# EAGLE design Hardware-Neuron (EAGLE 9.3.0)
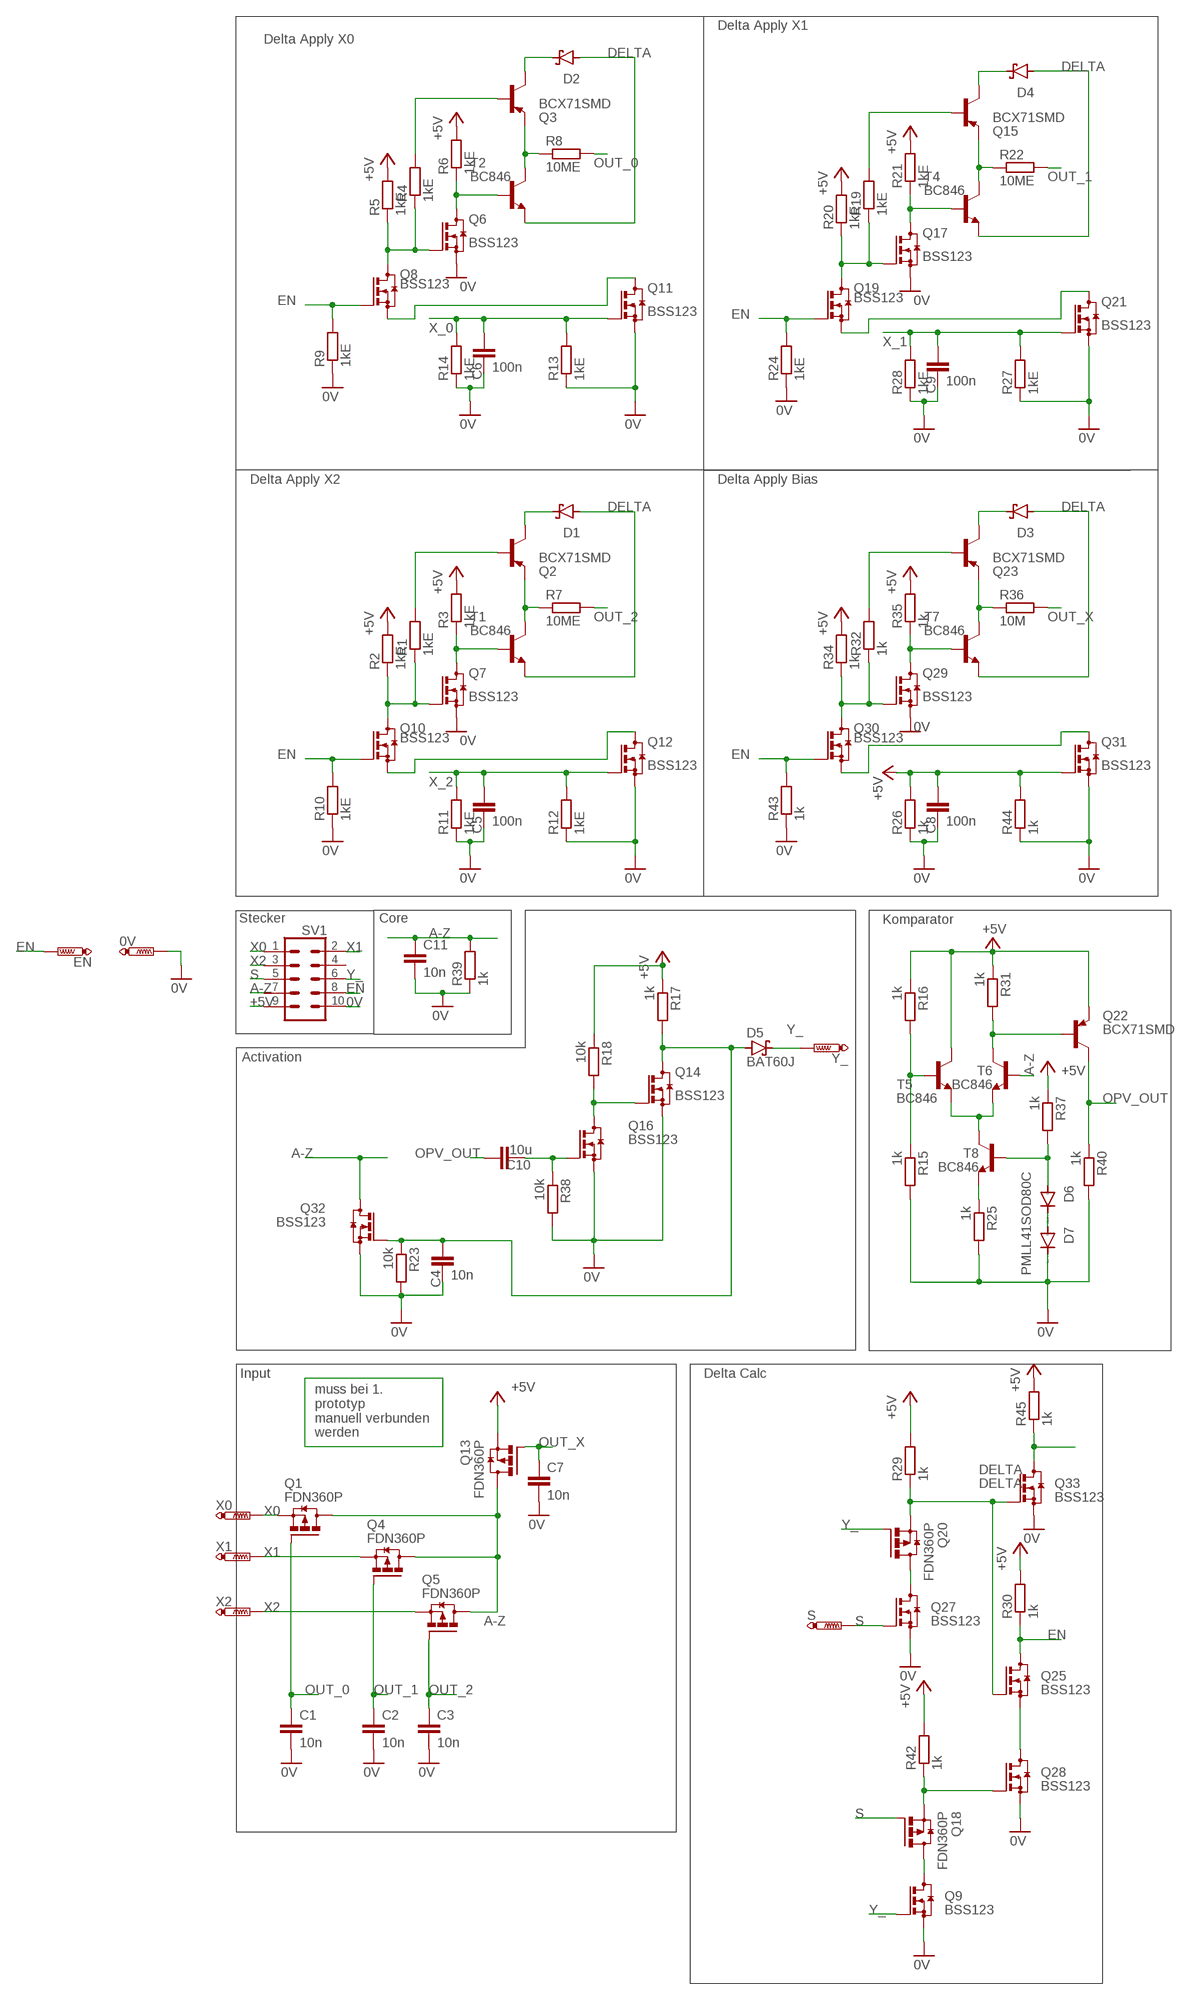
[diagram p0: schematic, sheet 1]

## Parts
0V  PTR1PAD1-17  [P1-17]
C1  10n  C-EUC0805  [C0805]
C2  10n  C-EUC0805  [C0805]
C3  10n  C-EUC0805  [C0805]
C4  10n  C-EUC0805  [C0805]
C5  100n  C-EUC0805  [C0805]
C6  100n  C-EUC0805  [C0805]
C7  10n  C-EUC0805  [C0805]
C8  100n  C-EUC0805  [C0805]
C9  100n  C-EUC0805  [C0805]
C10  10u  C-EUC0805  [C0805]
C11  10n  C-EUC0805  [C0805]
D1  BAT60J  [SOD323_ST]
D2  BAT60J  [SOD323_ST]
D3  BAT60J  [SOD323_ST]
D4  BAT60J  [SOD323_ST]
D5  BAT60J  [SOD323_ST]
D6  PMLL41SOD80C  [SOD80C]
D7  PMLL41SOD80C  [SOD80C]
EN  PTR1PAD1-17  [P1-17]
Q1  FDN360P  [SUPER-SOT3]
Q2  BCX71SMD  [SOT23]
Q3  BCX71SMD  [SOT23]
Q4  FDN360P  [SUPER-SOT3]
Q5  FDN360P  [SUPER-SOT3]
Q6  BSS123  [SOT23]
Q7  BSS123  [SOT23]
Q8  BSS123  [SOT23]
Q9  BSS123  [SOT23]
Q10  BSS123  [SOT23]
Q11  BSS123  [SOT23]
Q12  BSS123  [SOT23]
Q13  FDN360P  [SUPER-SOT3]
Q14  BSS123  [SOT23]
Q15  BCX71SMD  [SOT23]
Q16  BSS123  [SOT23]
Q17  BSS123  [SOT23]
Q18  FDN360P  [SUPER-SOT3]
Q19  BSS123  [SOT23]
Q20  FDN360P  [SUPER-SOT3]
Q21  BSS123  [SOT23]
Q22  BCX71SMD  [SOT23]
Q23  BCX71SMD  [SOT23]
Q25  BSS123  [SOT23]
Q27  BSS123  [SOT23]
Q28  BSS123  [SOT23]
Q29  BSS123  [SOT23]
Q30  BSS123  [SOT23]
Q31  BSS123  [SOT23]
Q32  BSS123  [SOT23]
Q33  BSS123  [SOT23]
R1  1kE  R-EU_M0805  [M0805]
R2  1kE  R-EU_M0805  [M0805]
R3  1kE  R-EU_M0805  [M0805]
R4  1kE  R-EU_M0805  [M0805]
R5  1kE  R-EU_M0805  [M0805]
R6  1kE  R-EU_M0805  [M0805]
R7  10ME  R-EU_M0805  [M0805]
R8  10ME  R-EU_M0805  [M0805]
R9  1kE  R-EU_M0805  [M0805]
R10  1kE  R-EU_M0805  [M0805]
R11  1kE  R-EU_M0805  [M0805]
R12  1kE  R-EU_M0805  [M0805]
R13  1kE  R-EU_M0805  [M0805]
R14  1kE  R-EU_M0805  [M0805]
R15  1k  R-EU_M0805  [M0805]
R16  1k  R-EU_M0805  [M0805]
R17  1k  R-EU_M0805  [M0805]
R18  10k  R-EU_M0805  [M0805]
R19  1kE  R-EU_M0805  [M0805]
R20  1kE  R-EU_M0805  [M0805]
R21  1kE  R-EU_M0805  [M0805]
R22  10ME  R-EU_M0805  [M0805]
R23  10k  R-EU_M0805  [M0805]
R24  1kE  R-EU_M0805  [M0805]
R25  1k  R-EU_M0805  [M0805]
R26  1k  R-EU_M0805  [M0805]
R27  1kE  R-EU_M0805  [M0805]
R28  1kE  R-EU_M0805  [M0805]
R29  1k  R-EU_M0805  [M0805]
R30  1k  R-EU_M0805  [M0805]
R31  1k  R-EU_M0805  [M0805]
R32  1k  R-EU_M0805  [M0805]
R34  1k  R-EU_M0805  [M0805]
R35  1k  R-EU_M0805  [M0805]
R36  10M  R-EU_M0805  [M0805]
R37  1k  R-EU_M0805  [M0805]
R38  10k  R-EU_M0805  [M0805]
R39  1k  R-EU_M0805  [M0805]
R40  1k  R-EU_M0805  [M0805]
R42  1k  R-EU_M0805  [M0805]
R43  1k  R-EU_M0805  [M0805]
R44  1k  R-EU_M0805  [M0805]
R45  1k  R-EU_M0805  [M0805]
S  PTR1PAD1-17  [P1-17]
SV1  ML10  [ML10]
T1  BC846  [SOT23]
T2  BC846  [SOT23]
T4  BC846  [SOT23]
T5  BC846  [SOT23]
T6  BC846  [SOT23]
T7  BC846  [SOT23]
T8  BC846  [SOT23]
X0  PTR1PAD1-17  [P1-17]
X1  PTR1PAD1-17  [P1-17]
X2  PTR1PAD1-17  [P1-17]
Y_  PTR1PAD1-17  [P1-17]

## Nets
0V: 0V.TP C1.2 C2.2 C3.2 C4.2 C5.2 C6.2 C7.2 C8.2 C9.2 C11.2 D7.C Q6.2(S) Q7.2(S) Q9.2(S) Q11.2(S) Q12.2(S) Q14.2(S) Q16.2(S) Q17.2(S) Q21.2(S) Q27.2(S) Q28.2(S) Q29.2(S) Q31.2(S) Q32.2(S) Q33.2(S) R9.1 R10.1 R11.1 R12.1 R13.1 R14.1 R15.2 R23.2 R24.1 R25.2 R26.1 R27.1 R28.1 R38.2 R39.1 R40.2 R43.1 R44.1 SV1.10
+5V: C8.1 Q13.2(S) Q22.2(E) Q31.1(G) R2.2 R3.2 R5.2 R6.2 R16.1 R17.1 R18.1 R20.2 R21.2 R26.2 R29.2 R30.2 R31.1 R34.2 R35.2 R37.1 R42.2 R44.2 R45.2 SV1.9 T5.3(C)
A-Z: C11.1 Q1.3(D) Q4.3(D) Q5.3(D) Q13.3(D) Q32.3(D) R39.2 SV1.7 T6.1(B)
DELTA: D1.A D2.A D3.A D4.A Q20.2(S) Q25.1(G) Q33.1(G) R29.1 T1.2(E) T2.2(E) T4.2(E) T7.2(E)
EN: EN.TP Q8.1(G) Q10.1(G) Q19.1(G) Q25.3(D) Q30.1(G) R9.2 R10.2 R24.2 R30.1 R43.2 SV1.8
N$1: Q29.3(D) R35.1 T7.1(B)
N$2: Q23.2(E) R36.1 T7.3(C)
N$3: C10.2 Q16.1(G) R38.1
N$4: Q33.3(D) R45.1
N$5: Q14.1(G) Q16.3(D) R18.2
N$6: Q6.3(D) R6.1 T2.1(B)
N$7: Q8.2(S) Q11.3(D)
N$8: Q3.2(E) R8.1 T2.3(C)
N$9: D3.C Q23.3(C)
N$10: Q23.1(B) R32.2
N$11: Q29.1(G) Q30.3(D) R32.1 R34.1
N$12: Q30.2(S) Q31.3(D)
N$13: D6.C D7.A
N$14: R15.1 R16.2 T5.1(B)
N$16: C4.1 D5.A Q14.3(D) Q32.1(G) R17.2 R23.1
N$17: Q9.3(D) Q18.3(D)
N$25: R25.1 T8.2(E)
N$26: Q22.1(B) R31.2 T6.3(C)
N$27: T5.2(E) T6.2(E) T8.3(C)
N$28: Q17.3(D) R21.1 T4.1(B)
N$29: D6.A R37.2 T8.1(B)
N$31: D2.C Q3.3(C)
N$32: Q20.3(D) Q27.3(D)
N$33: Q15.2(E) R22.1 T4.3(C)
N$34: Q3.1(B) R4.2
N$35: Q6.1(G) Q8.3(D) R4.1 R5.1
N$36: Q18.2(S) Q28.1(G) R42.1
N$38: D4.C Q15.3(C)
N$39: Q15.1(B) R19.2
N$40: Q25.2(S) Q28.3(D)
N$41: Q17.1(G) Q19.3(D) R19.1 R20.1
N$42: Q19.2(S) Q21.3(D)
N$50: Q7.3(D) R3.1 T1.1(B)
N$51: Q2.2(E) R7.1 T1.3(C)
N$52: D1.C Q2.3(C)
N$53: Q2.1(B) R1.2
N$54: Q7.1(G) Q10.3(D) R1.1 R2.1
N$55: Q10.2(S) Q12.3(D)
OPV_OUT: C10.1 Q22.3(C) R40.1
OUT_0: C1.1 Q1.1(G) R8.2
OUT_1: C2.1 Q4.1(G) R22.2
OUT_2: C3.1 Q5.1(G) R7.2
OUT_X: C7.1 Q13.1(G) R36.2
S: Q18.1(G) Q27.1(G) S.TP SV1.5
X0: Q1.2(S) SV1.1 X0.TP
X1: Q4.2(S) SV1.2 X1.TP
X2: Q5.2(S) SV1.3 X2.TP
X_0: C6.1 Q11.1(G) R13.2 R14.2
X_1: C9.1 Q21.1(G) R27.2 R28.2
X_2: C5.1 Q12.1(G) R11.2 R12.2
Y_: D5.C Q9.1(G) Q20.1(G) SV1.6 Y_.TP
Unconnected: SV1.4

## Notes on the sheet
- Delta Apply X1
- Delta Apply X0
- Delta Apply X2 | Delta Apply Bias
- Stecker | Core | Komparator
- Activation
- Input | Delta Calc
- muss bei 1.
  prototyp 
  manuell verbunden
  werden

## Library data of the parts
0V EN S X0 X1 X2 Y_ = testpad:PTR1: TEST PIN
C1-C11 = rcl:C-EU: CAPACITOR, European symbol; SPICEPREFIX: C
D1-D5 = diode:BAT60J: Schottky barrier diode Source: www.st.com, BAT60J.pdf
D6 D7 = diode:PMLL41*: High-speed diodes Source: http://www.semiconductors.philips.com/acrobat_download/datasheets/PMLL4150_2.pdf
Q1 Q4 Q5 Q13 Q18 Q20 = transistor-power:FDN360P: Single P-Channel, PowerTrench (R) MOSFET Source: http://www.fairchildsemi.com/ds/FD/FDN360P.pdf
Q2 Q3 Q15 Q22 Q23 = transistor-pnp:BCX71SMD: PNP Transistor
Q6-Q12 Q14 Q16 Q17 Q19 Q21 Q25 Q27-Q33 = transistor-small-signal:BSS123: N-CHANNEL MOS FET
R1-R32 R34-R40 R42-R45 = rcl:R-EU_: RESISTOR, European symbol; SPICEPREFIX: R
SV1 = con-harting-ml:ML10: HARTING; OC_FARNELL: unknown; OC_NEWARK: unknown
T1 T2 T4-T8 = transistor:BC846: NPN TRANSISTOR

## Board
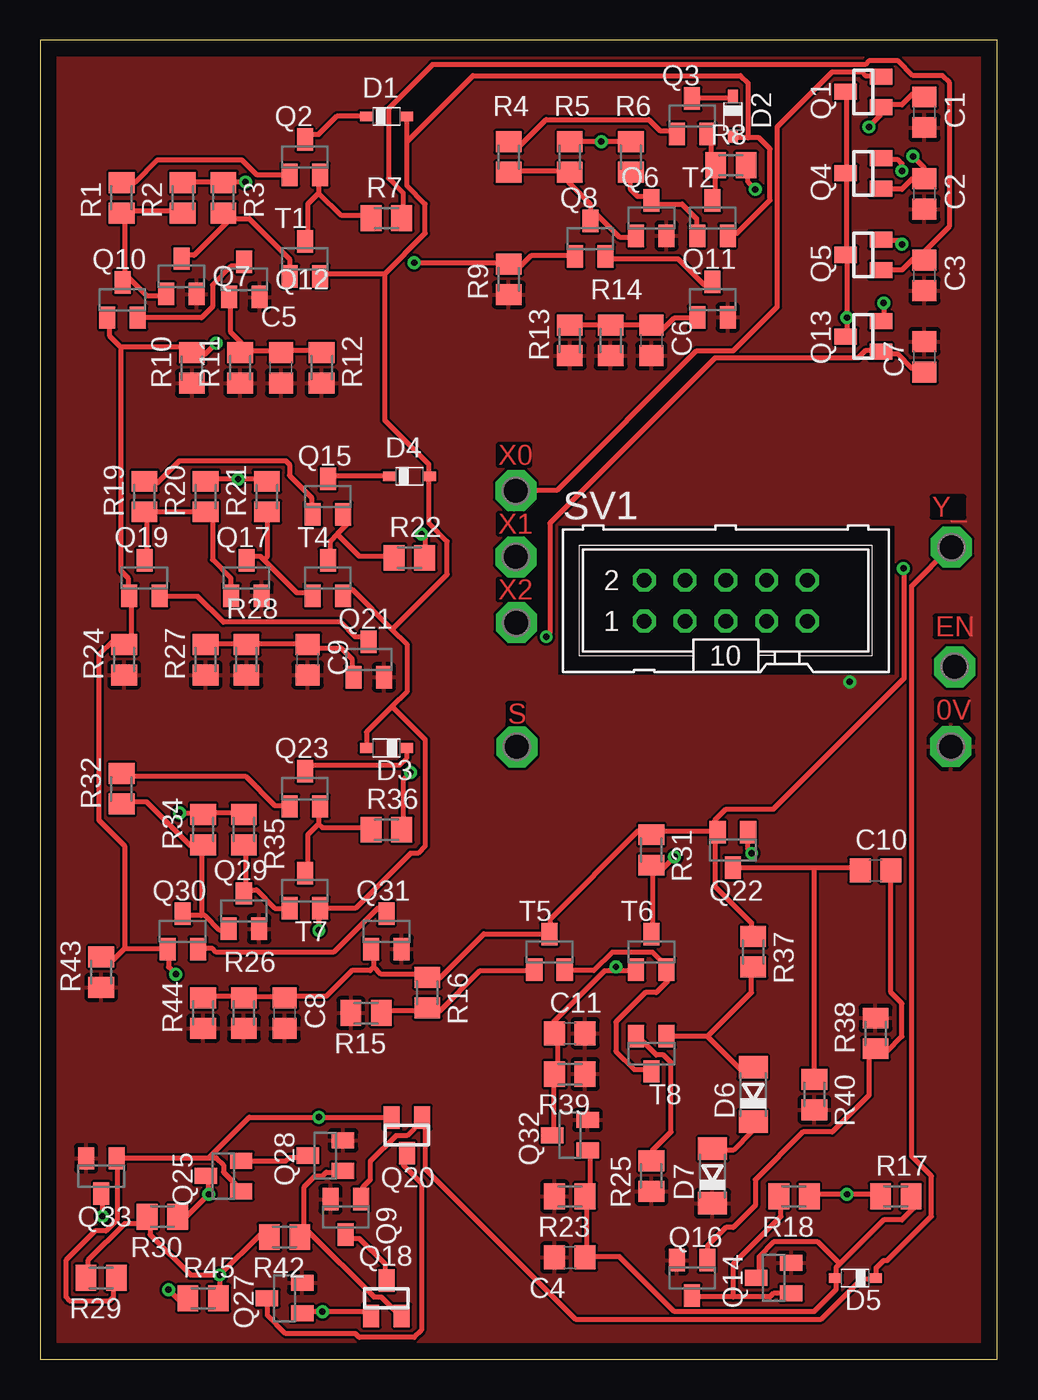
[diagram p1: board, top side]
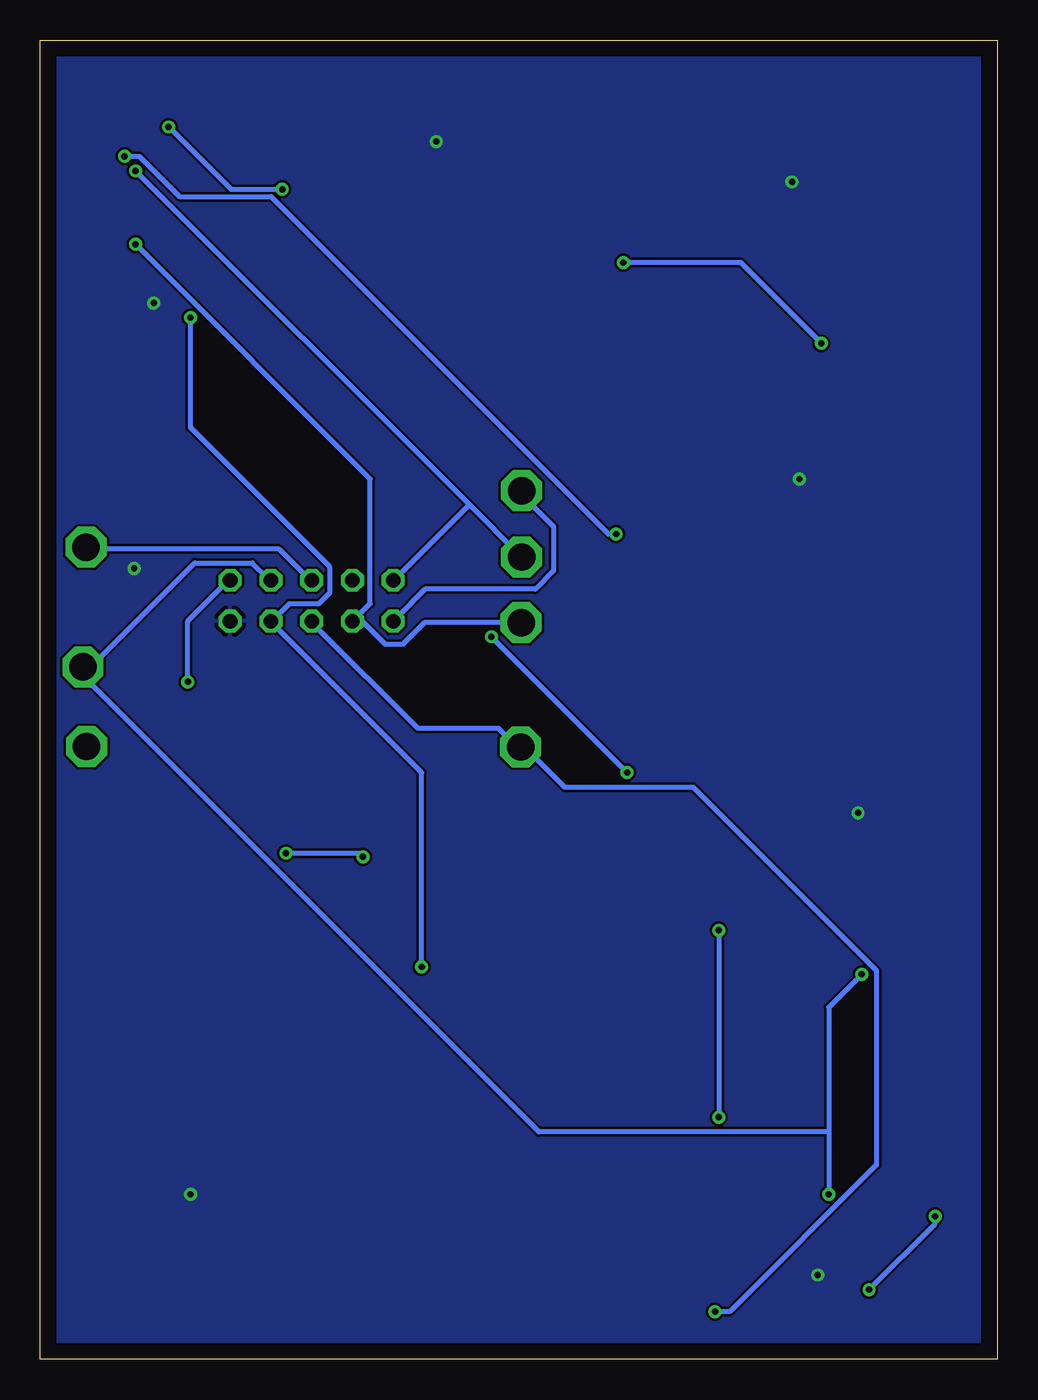
[diagram p2: board, bottom side, seen from below]

Size 59.67 x 82.22 mm. Coordinates in mm from the lower left corner, seen from the top.
Outline: 0,0 59.67,0 59.67,82.22 0,82.22 0,0
Copper layers (1*16): Top 0.035mm / dielectric 1.5mm / Bottom 0.035mm
Design rules "default *": minimum track width 12mil, minimum drill 0.4mm, track to track 6mil, track to pad 6mil, pad to pad 6mil, via to via 6mil, smd to smd 6mil, copper to edge 40mil, drill to drill 6mil, minimum pad ring 10mil, minimum via ring 8mil, stop-mask expansion 4mil, vias tented up to drill 0mil, thermal gap 10mil
tKeepout: area 32.4,48.5 to 55.1,58.3
tRestrict: area 32.3,42.7 to 53.3,51.9

### Footprints (pad centres in the part's own frame; a part is rotated, then mirrored left to right if it is on the bottom)
P1-17 = drill 1.702 pad 2.54 octagon: TP 0,0
C0805 = smd 1.3 x 1.5: 1 -0.95,0; 2 0.95,0
SOD323_ST = smd 0.8 x 0.6: A 1.25,0; C -1.25,0
SOD80C = smd 1.4 x 1.8: A 1.7,0; C -1.7,0
SUPER-SOT3 = smd 1 x 1.4: 1 -0.95,-1.1; 2 0.95,-1.1; 3 0,1.1
SOT23 = smd 1 x 1.4: 1 -0.95,-1.1; 2 0.95,-1.1; 3 0,1.1
M0805 = smd 1.3 x 1.6: 1 -0.95,0; 2 0.95,0
ML10 = drill 0.914 octagon: 1 -5.08,-1.27; 2 -5.08,1.27; 3 -2.54,-1.27; 4 -2.54,1.27; 5 0,-1.27; 6 0,1.27; 7 2.54,-1.27; 8 2.54,1.27; 9 5.08,-1.27; 10 5.08,1.27

### Placement (x,y rotation side)
0V  56.77,38.19 0 top
C1  55.12,77.72 270 top
C2  55.12,72.64 270 top
C3  55.12,67.56 270 top
C4  33.02,6.35 180 top
C5  15.01,61.8 270 top
C6  38.1,63.5 270 top
C7  55.12,62.48 90 top
C8  15.24,21.59 270 top
C9  16.67,43.61 270 top
C10  52.07,30.48 0 top
C11  33.02,20.32 0 top
D1  21.59,77.47 0 top
D2  43.18,77.47 270 top
D3  21.59,38.1 180 top
D4  23.02,55.04 0 top
D5  50.8,5.08 180 top
D6  44.45,16.51 90 top
D7  41.91,11.43 90 top
EN  57,43.16 0 top
Q1  51.31,78.99 90 top
Q2  16.51,74.93 0 top
Q3  40.64,77.47 0 top
Q4  51.31,73.91 90 top
Q5  51.31,68.83 90 top
Q6  38.1,71.12 0 top
Q7  8.82,67.5 0 top
Q8  34.29,69.85 0 top
Q9  19.05,8.89 180 top
Q10  5.14,66.02 0 top
Q11  41.91,66.04 0 top
Q12  12.72,67.3 0 top
Q13  51.31,63.75 90 top
Q14  45.72,5.08 90 top
Q15  17.94,53.77 0 top
Q16  40.64,5.08 180 top
Q17  12.86,48.69 0 top
Q18  21.59,3.81 0 top
Q19  6.51,48.69 0 top
Q20  22.86,13.97 180 top
Q21  20.48,43.61 0 top
Q22  43.18,31.75 180 top
Q23  16.51,35.56 0 top
Q25  11.43,11.43 90 top
Q27  15.24,3.81 90 top
Q28  17.78,12.7 90 top
Q29  12.7,27.94 0 top
Q30  8.89,26.67 0 top
Q31  21.59,26.67 0 top
Q32  33.02,13.97 90 top
Q33  3.81,11.43 180 top
R1  5.08,72.39 90 top
R2  8.89,72.39 90 top
R3  11.43,72.39 90 top
R4  29.21,74.93 90 top
R5  33.02,74.93 90 top
R6  36.83,74.93 90 top
R7  21.59,71.12 0 top
R8  43.05,74.42 0 top
R9  29.21,67.31 90 top
R10  9.47,61.78 90 top
R11  12.47,61.8 90 top
R12  17.55,61.8 90 top
R13  33.02,63.5 90 top
R14  35.56,63.5 90 top
R15  20.32,21.59 180 top
R16  24.13,22.86 270 top
R17  53.34,10.16 0 top
R18  46.99,10.16 180 top
R19  6.51,53.77 90 top
R20  10.32,53.77 90 top
R21  14.13,53.77 90 top
R22  23.02,49.96 0 top
R23  33.02,10.16 180 top
R24  5.24,43.61 90 top
R25  38.1,11.43 270 top
R26  12.7,21.59 90 top
R27  10.32,43.61 90 top
R28  12.86,43.61 90 top
R29  3.81,5.08 180 top
R30  7.62,8.89 180 top
R31  38.1,31.75 270 top
R32  5.08,35.56 90 top
R34  10.16,33.02 90 top
R35  12.7,33.02 90 top
R36  21.59,33.02 0 top
R37  44.45,25.4 270 top
R38  52.07,20.32 90 top
R39  33.02,17.78 180 top
R40  48.26,16.51 270 top
R42  15.24,7.62 180 top
R43  3.81,24.13 90 top
R44  10.16,21.59 90 top
R45  10.16,3.81 0 top
S  29.71,38.17 0 top
SV1  42.74,47.28 0 top
T1  16.51,68.58 0 top
T2  41.91,71.12 0 top
T4  17.94,48.69 0 top
T5  31.75,25.4 0 top
T6  38.1,25.4 0 top
T7  16.51,29.21 0 top
T8  38.1,19.05 180 top
X0  29.66,54.14 0 top
X1  29.66,50.01 0 top
X2  29.69,45.91 0 top
Y_  56.81,50.61 0 top

### Tracks (layer width: path | path; a pad name or v marks a point on that pad's centre or on a via)
0V  (via drill 0.4)
  Bottom 0.305: v50.46,42.23 50.46,46.01 48.01,48.46 SV1.10
  pour Top: 0.19,82.1 0.19,-0.03 59.68,-0.03 59.68,82.1
+5V  (via drill 0.4)
  Top 0.305: R44.2 10.29,22.63 12.57,22.63 R26.2 12.8,22.63 15.09,22.63 C8.1 15.32,22.63 17.83,22.63 19.43,24.23 20.57,24.23 20.8,24.46 | 20.8,24.46 20.8,25.38 Q31.1 | 20.8,24.46 21.26,24 24,24 R16.1 24.23,23.77 24.92,23.77 27.66,26.52 31.55,26.52 T5.3 31.77,26.52 31.77,27.43 37.26,32.92 37.95,32.92 R31.1 38.18,32.92 42.06,32.92 | v11.2,5.26 11.2,3.89 R45.2 | v11.2,5.26 13.72,7.77 14.17,7.77 R42.2 | R29.2 2.97,5.26 2.97,6.17 5.26,8.46 6.4,8.46 6.63,8.69 R30.2 6.86,8.69 6.86,7.77 9.37,5.26 v11.2,5.26 | R18.1 48.01,10.29 v50.29,10.29 52.35,10.29 R17.1 | R5.2 33.15,75.89 v34.98,75.89 36.8,75.89 R6.2 | R20.2 10.52,54.86 v12.34,54.86 13.95,54.86 R21.2 | 11.43,73.38 8.91,73.38 R2.2 | R35.2 12.57,34.06 10.29,34.06 R34.2 10.06,34.06 v8.69,34.06 | v52.58,65.84 52.58,64.92 Q13.2 | v53.81,49.3 53.85,49.25 53.85,42.42 45.72,34.29 42.75,34.29 42.06,33.6 42.06,32.92 | 42.06,32.92 Q22.2 42.06,32.69 42.06,29.49 44.35,27.2 44.35,26.52 R37.1 | v12.8,73.38 11.43,73.38 | 11.43,73.38 R3.2
  pour Bottom: 0,82.19 0,0.06 59.68,0.06 59.68,82.19
A-Z  (via drill 0.4)
  Top 0.305: Q13.3 50.29,63.78 v50.29,64.92 50.29,68.81 Q5.3 50.29,69.04 50.29,73.84 Q4.3 50.29,74.07 50.29,78.87 Q1.3 | Q32.3 32,14.17 32,17.6 R39.2 32.23,17.83 32.23,20.12 C11.1 32,20.34 32,21.03 35.2,24.23 35.89,24.23 | 35.89,24.23 37.03,24.23 T6.1 | 35.89,24.23 v35.89,24.46
  Bottom 0.305: 45.26,45.95 35.89,36.58 v35.89,24.46 | v50.29,64.92 50.29,58.06 41.6,49.38 41.6,47.78 42.29,47.09 44.12,47.09 45.26,45.95 | 45.26,45.95 SV1.7
DELTA  (via drill 0.4)
  Top 0.305: 44.12,76.12 44.81,76.12 45.49,75.44 45.49,72.24 43.43,70.18 42.98,70.18 T2.2 | 44.12,76.12 43.2,76.12 D2.A | 22.86,75.89 22.86,73.15 24,72.01 24,70.18 21.49,67.67 | 22.86,75.89 22.86,77.27 D1.A | 21.49,67.67 17.6,67.67 T1.2 | 44.12,76.12 44.12,79.55 43.66,80.01 26.98,80.01 22.86,75.89 | 10.52,12.57 4.8,12.57 Q33.1 4.8,12.34 4.8,8.69 4.12,8 3.43,8 1.6,6.17 1.6,3.89 1.83,3.66 4.34,3.66 4.57,3.89 4.57,5.03 R29.1 | 10.52,12.57 10.97,12.57 11.43,12.12 11.43,11.66 12.34,10.74 12.34,10.52 Q25.1 | 10.52,12.57 13.03,15.09 v17.37,15.09 21.72,15.09 Q20.2 | 21.95,40.69 22.86,41.6 22.86,44.58 21.95,45.49 | 21.95,40.69 20.34,39.09 20.34,38.18 D3.A | 21.95,45.49 19.43,48.01 19.2,48.01 18.97,47.78 T4.2 | 21.95,45.49 25.38,48.92 25.38,50.98 24.23,52.12 24.23,54.86 D4.A 24.23,55.09 24.23,55.78 21.49,58.52 21.49,67.67 | 21.95,40.69 24,38.63 24,32 23.55,31.55 23.09,31.55 19.66,28.12 17.6,28.12 T7.2 17.37,27.89 v17.37,26.75
  Bottom 0.305: v17.37,26.75 v17.37,15.09
EN  (via drill 0.4)
  Top 0.305: Q25.3 10.52,11.43 v10.52,10.29 9.14,8.91 8.69,8.91 R30.1 | 5.26,25.6 7.77,25.6 Q30.1 8,25.38 8,24.46 v8.46,24 | 5.26,25.6 4.57,24.92 3.89,24.92 R43.2 | Q8.1 33.15,68.81 30.63,68.81 29.95,68.12 29.26,68.12 R9.2 29.03,68.35 v23.32,68.35 | 5.03,63.09 4.34,63.78 4.34,64.92 Q10.1 | 5.03,63.09 9.14,63.09 9.37,62.87 R10.2 9.6,62.64 10.29,62.64 v10.97,63.32 | 5.03,63.09 5.03,49.15 5.49,48.69 5.49,47.78 Q19.1 5.71,47.55 5.71,45.03 5.26,44.58 R24.2 5.03,44.58 4.8,44.81 4.57,44.81 3.66,43.89 3.66,33.6 5.26,32 5.26,25.6
  Bottom 0.305: SV1.8 45.49,48.69 46.44,49.64 50.03,49.64 56.69,42.98 56.98,42.98 EN.TP 56.92,42.52 28.57,14.17 10.52,14.17 | 10.52,14.17 10.52,21.95 v8.46,24 | 10.52,14.17 v10.52,10.29 | v23.32,68.35 16,68.35 v10.97,63.32
N$1
  Top 0.305: 12.8,29.26 12.8,32 R35.1 | 12.8,29.26 13.49,29.26 14.63,28.12 15.54,28.12 T7.1 | 12.8,29.26 Q29.3
N$2
  Top 0.305: 17.37,33.38 16.69,32.69 16.69,30.4 T7.3 | 17.37,33.38 17.37,34.29 Q23.2 | 17.37,33.38 17.6,33.15 20.57,33.15 R36.1
N$3
  Top 0.305: Q16.1 41.6,6.4 41.6,7.09 42.75,8.23 43.2,8.23 44.58,9.6 44.58,11.2 47.55,14.17 49.38,14.17 51.66,16.46 51.66,18.97 51.89,19.2 R38.1 52.12,19.2 52.81,19.2 53.72,20.12 53.72,22.17 53.03,22.86 53.03,30.4 C10.2
N$4  (via drill 0.4)
  Top 0.305: v3.89,8.91 3.89,10.29 Q33.3 | v8,4.34 8.69,3.66 9.14,3.66 R45.1
  Bottom 0.305: v3.89,8.91 3.89,8.46 v8,4.34
N$5
  Top 0.305: 43.2,3.89 45.49,3.89 45.72,4.12 46.63,4.12 Q14.1 | 43.2,3.89 40.69,3.89 Q16.3 | 43.2,3.89 43.2,5.94 46.18,8.91 46.18,10.06 R18.2
N$6
  Top 0.305: T2.1 40.92,70.18 40.92,71.09 40.01,72.01 38.18,72.01 Q6.3 38.18,72.24 37.95,72.47 37.26,72.47 36.8,72.92 36.8,73.84 R6.1
N$7
  Top 0.305: Q8.2 35.43,68.58 39.78,68.58 41.38,66.98 41.83,66.98 Q11.3
N$8
  Top 0.305: T2.3 42.06,72.24 42.06,74.3 R8.1 42.06,74.52 41.83,74.75 41.83,75.67 41.6,75.89 41.6,76.35 Q3.2
N$9
  Top 0.305: D3.C 22.86,37.95 22.86,37.49 22.4,37.03 16.69,37.03 16.46,36.8 Q23.3
N$10
  Top 0.305: Q23.1 15.54,34.52 14.63,34.52 12.8,36.35 5.26,36.35 R32.2
N$11
  Top 0.305: 10.06,27.66 10.29,27.66 11.2,26.75 11.66,26.75 Q29.1 | 10.06,27.66 8.91,27.66 Q30.3 | 10.06,32 9.37,32 6.63,34.75 5.26,34.75 R32.1 | 10.06,32 10.06,27.66 | 10.06,32 R34.1
N$12
  Top 0.305: Q30.2 10.06,25.6 10.74,25.6 10.97,25.38 18.29,25.38 21.03,28.12 21.26,28.12 21.49,27.89 Q31.3
N$13
  Top 0.305: D7.A 42.06,13.03 43.2,13.03 44.35,14.17 44.35,14.63 D6.C
N$14
  Top 0.305: T5.1 30.63,24.23 27.43,24.23 24.92,21.72 24.23,21.72 R16.2 24,21.72 21.49,21.72 R15.1
N$16
  Top 0.305: Q32.1 34.29,12.8 34.29,10.52 34.06,10.29 R23.1 34.06,10.06 34.06,6.4 | 49.84,5.94 52.58,8.69 53.72,8.69 54.41,9.37 54.41,10.06 R17.2 | 49.84,5.94 49.61,5.71 49.61,5.26 D5.A 49.61,5.03 49.61,4.34 48.23,2.97 39.55,2.97 36.12,6.4 34.06,6.4 | 49.84,5.94 48.46,7.32 45.72,7.32 44.81,6.4 44.81,5.26 Q14.3 | 34.06,6.4 C4.1
N$17
  Top 0.305: Q18.3 21.49,5.03 21.49,5.94 19.89,7.54 19.2,7.54 18.97,7.77 Q9.3
N$25
  Top 0.305: T8.2 37.26,20.12 38.41,18.97 38.86,18.97 39.32,18.52 39.32,14.17 38.18,13.03 38.18,12.57 R25.1
N$26  (via drill 0.4)
  Top 0.305: 38.18,30.63 38.18,26.52 T6.3 | v44.35,31.55 44.12,31.77 44.12,32.69 Q22.1 | v39.55,31.32 38.86,30.63 38.18,30.63 | 38.18,30.63 R31.2
  Bottom 0.305: v44.35,31.55 39.78,31.55 v39.55,31.32
N$27
  Top 0.305: T5.2 32.92,24.23 34.52,24.23 35.66,25.38 38.18,25.38 39.09,24.46 T6.2 39.09,24.23 39.09,23.55 38.41,22.86 37.72,22.86 35.89,21.03 35.89,19.2 37.03,18.06 37.95,18.06 T8.3
N$28
  Top 0.305: 13.95,49.84 13.72,50.06 13.03,50.06 12.8,49.84 Q17.3 | 13.95,49.84 16,47.78 16.92,47.78 T4.1 | 13.95,49.84 14.17,50.06 14.17,52.81 R21.1
N$29
  Top 0.305: 41.6,20.12 39.09,20.12 T8.1 | 41.6,20.12 43.66,18.06 44.35,18.06 D6.A | 41.6,20.12 44.35,22.86 44.35,24.23 R37.2
N$31
  Top 0.305: D2.C 42.98,78.64 40.69,78.64 Q3.3
N$32
  Top 0.305: Q27.3 14.17,3.66 14.17,2.74 15.32,1.6 19.66,1.6 19.89,1.37 23.32,1.37 23.77,1.83 23.77,10.97 22.63,12.12 22.63,12.57 22.86,12.8 Q20.3
N$33
  Top 0.305: 18.52,51.44 19.2,52.12 19.2,52.35 18.97,52.58 Q15.2 | 18.52,51.44 18.06,50.98 18.06,49.84 T4.3 | 18.52,51.44 19.89,50.06 21.95,50.06 R22.1
N$34
  Top 0.305: Q3.1 39.55,76.58 38.63,76.58 37.95,77.27 31.55,77.27 29.95,75.67 29.26,75.67 R4.2
N$35
  Top 0.305: 34.29,71.32 34.29,72.01 32.92,73.38 32.92,73.84 R5.1 32.92,74.07 29.26,74.07 R4.1 | 34.29,71.32 34.75,71.32 36.12,69.95 37.03,69.95 Q6.1 | 34.29,71.32 Q8.3
N$36
  Top 0.305: 16.46,8 16.69,8 20.8,3.89 21.26,3.89 22.4,2.74 Q18.2 | 16.46,8 16.23,7.77 R42.1 16.46,8 | 16.46,8 16.46,10.74 17.14,11.43 17.6,11.43 17.83,11.66 18.75,11.66 Q28.1
N$38
  Top 0.305: D4.C 21.72,55.09 18.06,55.09 Q15.3
N$39
  Top 0.305: Q15.1 16.92,52.81 16.92,53.72 15.54,55.09 15.54,55.78 15.32,56.01 8.69,56.01 7.32,54.63 6.63,54.63 R19.2
N$40
  Top 0.305: Q25.2 12.57,12.34 15.32,12.34 15.54,12.57 16.46,12.57 Q28.3
N$41
  Top 0.305: 6.63,52.81 6.63,49.84 Q19.3 | Q17.1 11.89,47.78 11.89,48.69 10.74,49.84 10.74,52.58 10.52,52.81 R20.1 10.29,52.81 6.63,52.81 | 6.63,52.81 R19.1
N$42
  Top 0.305: Q19.2 7.54,47.55 9.83,47.55 11.43,45.95 18.75,45.95 19.66,45.03 20.34,45.03 20.57,44.81 Q21.3
N$50
  Top 0.305: 11.66,71.09 11.66,70.87 9.6,68.81 8.91,68.81 Q7.3 | 11.66,71.09 11.43,71.32 R3.1 11.66,71.09 | 11.66,71.09 13.03,71.09 15.54,68.58 15.54,67.67 T1.1
N$51
  Top 0.305: 17.37,72.69 16.69,72.01 16.69,69.72 T1.3 | 17.37,72.69 17.37,73.61 Q2.2 | 17.37,72.69 18.75,71.32 20.57,71.32 R7.1
N$52
  Top 0.305: D1.C 20.12,77.5 18.52,77.5 17.37,76.35 16.69,76.35 16.46,76.12 Q2.3
N$53
  Top 0.305: Q2.1 15.54,73.84 13.49,73.84 12.57,74.75 7.32,74.75 5.94,73.38 5.26,73.38 R1.2
N$54
  Top 0.305: 5.26,67.44 5.49,67.44 6.63,66.29 7.77,66.29 Q7.1 | 5.26,67.44 5.03,67.21 Q10.3 5.26,67.44 | R2.1 8.69,71.55 5.26,71.55 R1.1 5.26,71.32 5.26,67.44
N$55
  Top 0.305: Q10.2 6.17,64.92 10.06,64.92 10.74,65.61 10.74,66.98 11.89,68.12 12.57,68.12 12.8,68.35 Q12.3
OPV_OUT
  Top 0.305: 48.23,30.63 50.98,30.63 C10.1 | 48.23,30.63 43.2,30.63 Q22.3 | 48.23,30.63 48.23,17.6 R40.1
OUT_0  (via drill 0.4)
  Top 0.305: C1.1 55.09,78.87 54.41,78.87 53.72,78.18 52.58,78.18 Q1.1 52.35,77.95 52.35,77.5 v51.66,76.81 | v44.58,72.92 44.12,73.38 44.12,74.3 R8.2
  Bottom 0.305: v44.58,72.92 47.78,72.92 v51.66,76.81
OUT_1  (via drill 0.4)
  Top 0.305: 55.09,73.61 54.41,73.61 53.72,72.92 52.58,72.92 Q4.1 | v23.77,51.44 24,51.21 24,50.06 R22.2 | v54.41,74.98 55.09,74.3 55.09,73.61 | 55.09,73.61 C2.1
  Bottom 0.305: v23.77,51.44 24.23,51.44 45.26,72.47 50.98,72.47 53.49,74.98 v54.41,74.98
OUT_2
  Top 0.305: 54.63,68.58 55.09,68.58 C3.1 54.63,68.58 | 54.63,68.58 54.41,68.58 53.72,67.89 52.58,67.89 Q5.1 | 54.63,68.58 56.69,70.64 56.69,79.55 56.24,80.01 54.41,80.01 53.49,80.92 51.66,80.92 51.44,80.7 24.46,80.7 21.72,77.95 21.72,73.61 22.63,72.69 22.63,71.32 R7.2
OUT_X  (via drill 0.4)
  Top 0.305: C7.1 55.09,61.72 54.41,61.72 53.49,62.64 52.58,62.64 Q13.1 52.35,62.87 51.44,62.87 50.98,62.41 42.06,62.41 31.77,52.12 31.77,45.26 v31.55,45.03 | v23.09,36.58 22.63,36.12 22.63,33.15 R36.2
  Bottom 0.305: v31.55,45.03 v23.09,36.58
S  (via drill 0.4)
  Top 0.305: Q27.1 16.46,2.97 v17.6,2.97 20.34,2.97 20.57,2.74 Q18.1
  Bottom 0.305: SV1.5 42.52,45.95 42.52,45.72 36.12,39.32 31.09,39.32 29.72,37.95 S.TP 29.49,38.18 26.98,35.66 18.97,35.66 7.54,24.23 7.54,12.12 16.69,2.97 v17.6,2.97
X0
  Top 0.305: Q1.2 52.35,80.01 51.44,80.01 51.21,80.24 49.38,80.24 45.95,76.81 45.95,65.61 43.2,62.87 40.92,62.87 32.23,54.18 29.72,54.18 X0.TP
  Bottom 0.305: SV1.1 37.49,46.18 35.66,48.01 28.8,48.01 27.66,49.15 27.66,51.89 29.72,53.95 X0.TP
X1  (via drill 0.4)
  Top 0.305: v53.72,74.07 53.72,74.52 53.49,74.75 52.58,74.75 Q4.2
  Bottom 0.305: 32.92,53.26 29.72,50.06 X1.TP | 32.92,53.26 v53.72,74.07 | 32.92,53.26 37.49,48.69 SV1.2
X2  (via drill 0.4)
  Top 0.305: v53.72,69.49 53.49,69.72 52.58,69.72 Q5.2
  Bottom 0.305: v53.72,69.49 39.09,54.86 39.09,47.09 39.78,46.41 40.01,46.41 | 40.01,46.41 40.23,46.18 SV1.3 40.01,46.41 | 40.01,46.41 38.18,44.58 37.03,44.58 35.66,45.95 29.72,45.95 X2.TP
X_0
  Top 0.305: R13.2 33.15,64.47 35.43,64.47 R14.2 35.66,64.47 37.95,64.47 C6.1 38.18,64.24 38.86,64.24 39.55,64.92 40.92,64.92 Q11.1
X_1
  Top 0.305: R27.2 10.52,44.58 12.8,44.58 R28.2 13.03,44.58 16.46,44.58 C9.1 16.69,44.35 18.75,44.35 19.43,43.66 19.43,42.52 Q21.1
X_2
  Top 0.305: R12.2 17.37,62.87 15.09,62.87 C5.1 14.86,62.87 12.57,62.87 | 12.57,62.87 12.57,63.32 11.89,64.01 11.89,66.06 Q12.1 | 12.57,62.87 R11.2
Y_
  Top 0.305: Q9.1 20.12,10.06 20.12,10.74 20.57,11.2 20.57,12.34 22.17,13.95 22.86,13.95 23.77,14.86 Q20.1 24,14.86 24,11.89 33.38,2.52 48.69,2.52 51.21,5.03 51.89,5.03 D5.C 52.12,5.26 52.12,5.71 52.58,6.17 52.81,6.17 55.55,8.91 55.55,11.43 54.32,12.66 54.32,48.21 56.72,50.61 Y_.TP
  Bottom 0.305: SV1.6 42.75,48.69 42.98,48.69 44.81,50.52 56.7,50.52 Y_.TP

### Text on the board
Document: Delta Apply X1 | Delta Apply X0 | Input | Delta Apply X2 | Delta Apply Bias | Vergleicher und Komparator | Delta Calc